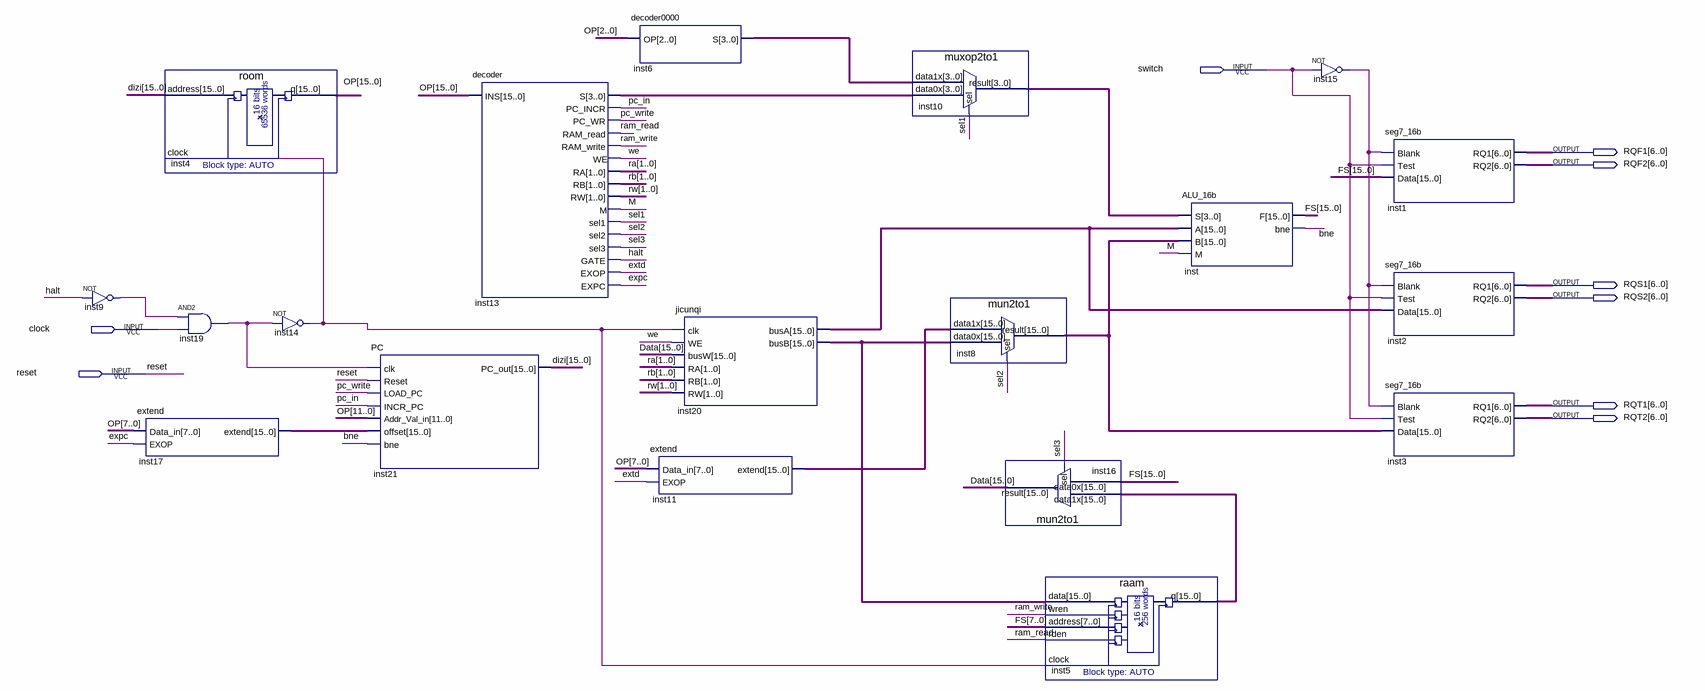
[diagram p0: schematic sheet]
// Quartus schematic CPU.bdf as structural Verilog: 19 symbols, 9 pins
module CPU (
  input  switch,
  input  clock,
  input  reset,
  output [6:0] RQF1,
  output [6:0] RQF2,
  output [6:0] RQS1,
  output [6:0] RQS2,
  output [6:0] RQT1,
  output [6:0] RQT2
);

  wire bne, expc, extd, halt, inst9_out, inst14_out, inst15_out, inst19_out, M, pc_in, pc_write, ram_read,
       ram_write, sel1, sel2, sel3, we;
  wire [1:0] ra, rb, rw;
  wire [3:0] inst6_s, inst10_result, inst13_s;
  wire [15:0] Data, dizi, FS, inst5_q, inst8_result, inst11_extend, inst17_extend, inst20_busa, inst20_busb,
       OP;

  not inst9 (inst9_out, halt);
  extend inst17 (.Data_in(OP[7:0]), .EXOP(expc), .extend(inst17_extend));
  room inst4 (.address(dizi), .clock(inst14_out), .q(OP));
  and inst19 (inst19_out, inst9_out, clock);
  not inst14 (inst14_out, inst19_out);
  PC inst21 (
    .clk(inst19_out), .Reset(reset), .LOAD_PC(pc_write), .INCR_PC(pc_in), .Addr_Val_in(OP[11:0]),
    .offset(inst17_extend), .bne(bne), .PC_out(dizi));
  decoder inst13 (
    .INS(OP), .S(inst13_s), .PC_INCR(pc_in), .PC_WR(pc_write), .RAM_read(ram_read), .RAM_write(ram_write),
    .WE(we), .RA(ra), .RB(rb), .RW(rw), .M(M), .sel1(sel1), .sel2(sel2), .sel3(sel3), .GATE(halt),
    .EXOP(extd), .EXPC(expc));
  decoder0000 inst6 (.OP(OP[2:0]), .S(inst6_s));
  extend inst11 (.Data_in(OP[7:0]), .EXOP(extd), .extend(inst11_extend));
  jicunqi inst20 (
    .clk(inst14_out), .WE(we), .busW(Data), .RA(ra), .RB(rb), .RW(rw), .busA(inst20_busa), .busB(inst20_busb));
  muxop2to1 inst10 (.data1x(inst6_s), .data0x(inst13_s), .sel(sel1), .result(inst10_result));
  mun2to1 inst8 (.data1x(inst11_extend), .data0x(inst20_busb), .sel(sel2), .result(inst8_result));
  mun2to1 inst16 (.data1x(inst5_q), .data0x(FS), .sel(sel3), .result(Data));
  raam inst5 (
    .data(inst20_busb), .wren(ram_write), .address(FS[7:0]), .rden(ram_read), .clock(inst14_out), .q(inst5_q));
  ALU_16b inst (.S(inst10_result), .A(inst20_busa), .B(inst8_result), .M(M), .F(FS), .bne(bne));
  not inst15 (inst15_out, switch);
  seg7_16b inst1 (.Blank(inst15_out), .Test(switch), .Data(FS), .RQ1(RQF1), .RQ2(RQF2));
  seg7_16b inst2 (.Blank(inst15_out), .Test(switch), .Data(inst20_busa), .RQ1(RQS1), .RQ2(RQS2));
  seg7_16b inst3 (.Blank(inst15_out), .Test(switch), .Data(inst8_result), .RQ1(RQT1), .RQ2(RQT2));
endmodule
